# Altium schematic sheet ECU_Sheet1.SchDoc
size A3
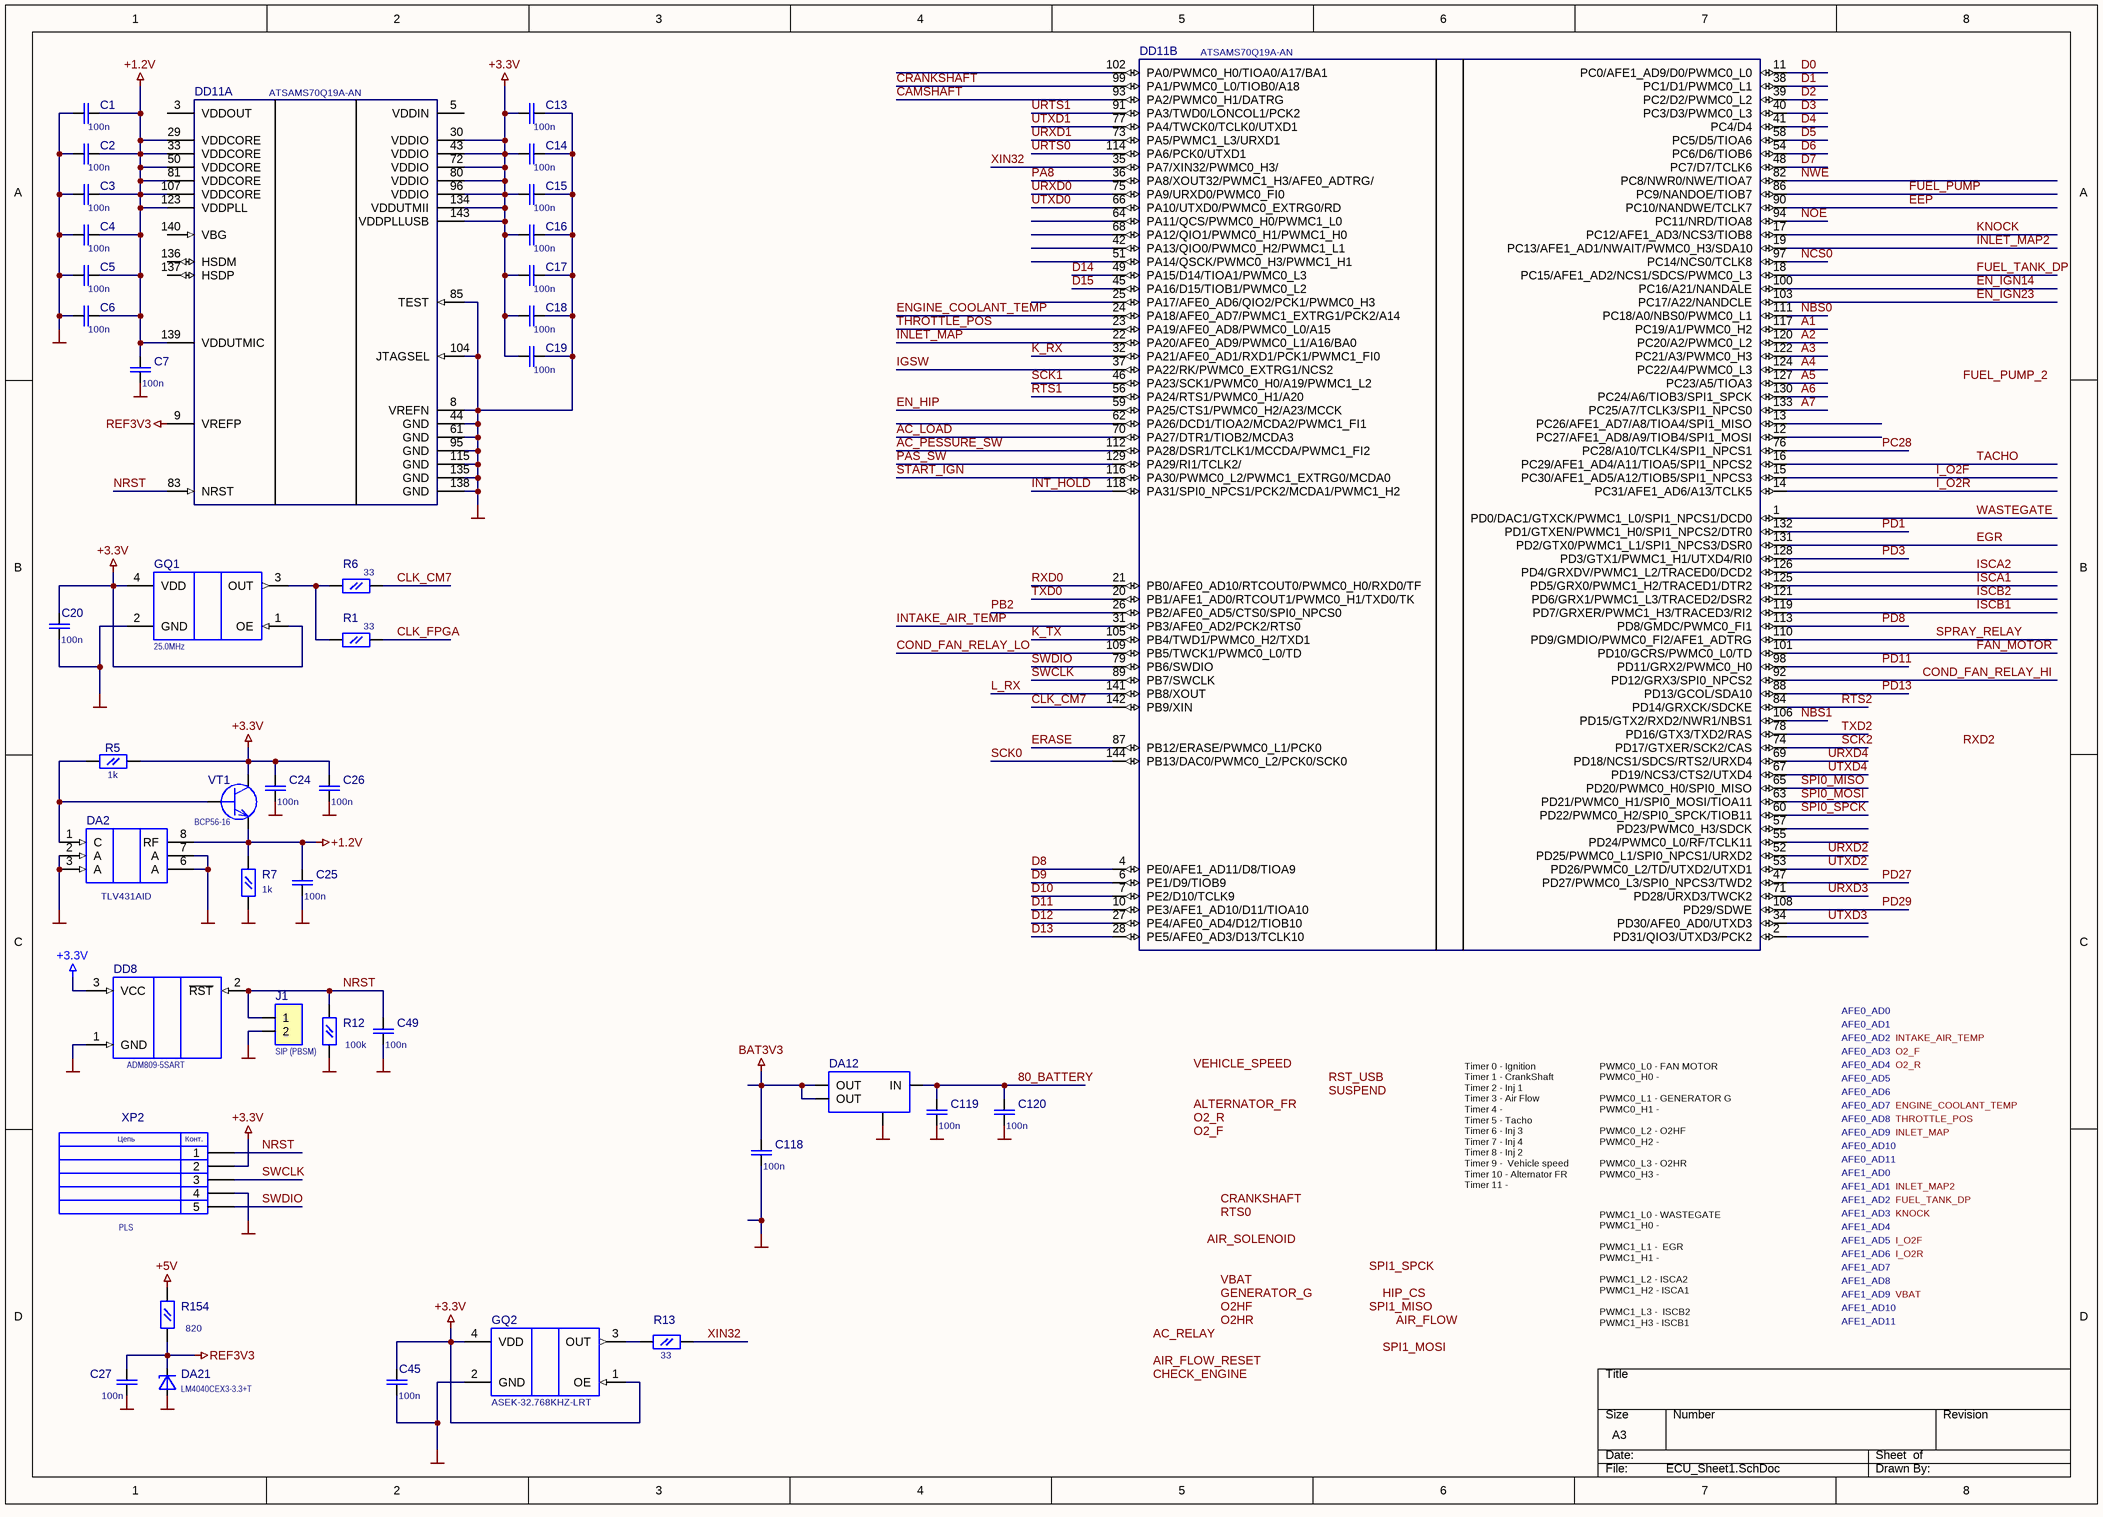
[diagram p0: ECU_Sheet1.SchDoc]

## Parts
C1  value 100n  [C0603L]  (hidden comment: 0.1мкФ-25В-X8R-10%)
C2  value 100n  [C0603L]  (hidden comment: 0.1мкФ-25В-X8R-10%)
C3  value 100n  [C0603L]  (hidden comment: 0.1мкФ-25В-X8R-10%)
C4  value 100n  [C0603L]  (hidden comment: 0.1мкФ-25В-X8R-10%)
C5  value 100n  [C0603L]  (hidden comment: 0.1мкФ-25В-X8R-10%)
C6  value 100n  [C0603L]  (hidden comment: 0.1мкФ-25В-X8R-10%)
C7  value 100n  [C0603L]  (hidden comment: 0.1мкФ-25В-X8R-10%)
C13  value 100n  [C0603L]  (hidden comment: 0.1мкФ-25В-X8R-10%)
C14  value 100n  [C0603L]  (hidden comment: 0.1мкФ-25В-X8R-10%)
C15  value 100n  [C0603L]  (hidden comment: 0.1мкФ-25В-X8R-10%)
C16  value 100n  [C0603L]  (hidden comment: 0.1мкФ-25В-X8R-10%)
C17  value 100n  [C0603L]  (hidden comment: 0.1мкФ-25В-X8R-10%)
C18  value 100n  [C0603L]  (hidden comment: 0.1мкФ-25В-X8R-10%)
C19  value 100n  [C0603L]  (hidden comment: 0.1мкФ-25В-X8R-10%)
C20  value 100n  [C0805L]  (hidden comment: 0.01мкФ-50В-X8R-10%)
C24  value 100n  [C0805L]  (hidden comment: 0.1мкФ-25В-X8R-10%)
C25  value 100n  [C0805L]  (hidden comment: 0.1мкФ-25В-X8R-10%)
C26  value 100n  [C0805L]  (hidden comment: 0.1мкФ-25В-X8R-10%)
C27  value 100n  [C0603L]  (hidden comment: 0.1мкФ-25В-X8R-10%)
C45  value 100n  [C0805L]  (hidden comment: 0.01мкФ-50В-X8R-10%)
C49  value 100n  [C0603L]  (hidden comment: 0.1мкФ-25В-X8R-10%)
C118  value 100n  [C0805L]  (hidden comment: 0.1мкФ-25В-X8R-10%)
C119  value 100n  [C0805L]  (hidden comment: CSMD)
C120  value 100n  [C0805L]  (hidden comment: CSMD)
DA2  TLV431AID  [SOIC8 JEDEC]
DA12  LM1117IMP-3.3  [SOT-223]  (value not drawn)
DA21  LM4040CEX3-3.3+T  [SOT-23]
DD8  ADM809-5SART  [SOT-23]
DD11  ATSAMS70Q19A-AN  [LQFP144]  (parts A,B of 2)
GQ1  25.0MHz  [KXO-97]
GQ2  ASEK-32.768KHZ-LRT  [QUARTZ-3.2mm-2.5mm]
J1  SIP (PBSM)  [SIP1X2S]
R1  value 33  [R0603L]  (hidden comment: 33-5%)
R5  value 1k  [R0805]  (hidden comment: 1к-5%)
R6  value 33  [R0603L]  (hidden comment: 33-5%)
R7  value 1k  [R0805L]  (hidden comment: 1к-5%)
R12  value 100k  [R0805L]  (hidden comment: 100к-5%)
R13  value 33  [R0603L]  (hidden comment: 33-5%)
R154  value 820  [R0805L]  (hidden comment: 100к-5%)
VT1  BCP56-16  [SOT-223 PWR]
XP2  PLS  [SIP5]

## Nets
+1.2V: C1.1 C2.1 C3.1 C4.1 C5.1 C6.1 C7.1 C25.1 DA2.8(RF) DD11.29(VDDCORE) DD11.33(VDDCORE) DD11.50(VDDCORE) DD11.81(VDDCORE) DD11.107(VDDCORE) DD11.123(VDDPLL) DD11.139(VDDUTMIC) R7.2(Pin2) VT1.3(E)
+3.3V: C13.2 C14.2 C15.2 C16.2 C17.2 C18.2 C19.2 C20.2 C24.1 C26.1 C45.2 DD8.3(VCC) DD11.30(VDDIO) DD11.43(VDDIO) DD11.72(VDDIO) DD11.80(VDDIO) DD11.96(VDDIO) DD11.134(VDDUTMII) DD11.143(VDDPLLUSB) GQ1.1(OE) GQ1.4(VDD) GQ2.1(OE) GQ2.4(VDD) R5.1(Pin1) VT1.2(C) XP2.2
+5V: R154.2(Pin2)
BAT3V3: C118.1 DA12.2(OUT) DA12.4(OUT)
GND: C1.2 C2.2 C3.2 C4.2 C5.2 C6.2 C7.2 C13.1 C14.1 C15.1 C16.1 C17.1 C18.1 C19.1 C20.1 C24.2 C25.2 C26.2 C27.2 C45.1 C49.2 C118.2 C119.2 C120.2 DA2.2(A) DA2.3(A) DA2.6(A) DA2.7(A) DA12.1(G) DA21.2 DD8.1(GND) DD11.8(VREFN) DD11.44(GND) DD11.61(GND) DD11.85(TEST) DD11.95(GND) DD11.104(JTAGSEL) DD11.115(GND) DD11.135(GND) DD11.138(GND) GQ1.2(GND) GQ2.2(GND) J1.2 R7.1(Pin1) R12.1(Pin1) XP2.4
REF3V3: C27.1 DA21.1 DD11.9(VREFP) R154.1(Pin1)
80_BATTERY: C119.1 C120.1 DA12.3(IN)
A1: DD11.117(PC19/A1/PWMC0_H2)
A2: DD11.120(PC20/A2/PWMC0_L2)
A3: DD11.122(PC21/A3/PWMC0_H3)
A4: DD11.124(PC22/A4/PWMC0_L3)
A5: DD11.127(PC23/A5/TIOA3)
A6: DD11.130(PC24/A6/TIOB3/SPI1_SPCK)
A7: DD11.133(PC25/A7/TCLK3/SPI1_NPCS0)
AC_LOAD: DD11.70(PA27/DTR1/TIOB2/MCDA3)
AC_PESSURE_SW: DD11.112(PA28/DSR1/TCLK1/MCCDA/PWMC1_FI2)
CAMSHAFT: DD11.93(PA2/PWMC0_H1/DATRG)
CLK_CM7: DD11.142(PB9/XIN) R6.2(Pin2)
CLK_FPGA: R1.2(Pin2)
COND_FAN_RELAY_HI: DD11.92(PD12/GRX3/SPI0_NPCS2)
COND_FAN_RELAY_LO: DD11.109(PB5/TWCK1/PWMC0_L0/TD)
CRANKSHAFT: DD11.99(PA1/PWMC0_L0/TIOB0/A18)
D0: DD11.11(PC0/AFE1_AD9/D0/PWMC0_L0)
D1: DD11.38(PC1/D1/PWMC0_L1)
D2: DD11.39(PC2/D2/PWMC0_L2)
D3: DD11.40(PC3/D3/PWMC0_L3)
D4: DD11.41(PC4/D4)
D5: DD11.58(PC5/D5/TIOA6)
D6: DD11.54(PC6/D6/TIOB6)
D7: DD11.48(PC7/D7/TCLK6)
D8: DD11.4(PE0/AFE1_AD11/D8/TIOA9)
D9: DD11.6(PE1/D9/TIOB9)
D10: DD11.7(PE2/D10/TCLK9)
D11: DD11.10(PE3/AFE1_AD10/D11/TIOA10)
D12: DD11.27(PE4/AFE0_AD4/D12/TIOB10)
D13: DD11.28(PE5/AFE0_AD3/D13/TCLK10)
D14: DD11.49(PA15/D14/TIOA1/PWMC0_L3)
D15: DD11.45(PA16/D15/TIOB1/PWMC0_L2)
EEP: DD11.90(PC10/NANDWE/TCLK7)
EGR: DD11.131(PD2/GTX0/PWMC1_L1/SPI1_NPCS3/DSR0)
EN_HIP: DD11.59(PA25/CTS1/PWMC0_H2/A23/MCCK)
EN_IGN14: DD11.100(PC16/A21/NANDALE)
EN_IGN23: DD11.103(PC17/A22/NANDCLE)
ENGINE_COOLANT_TEMP: DD11.24(PA18/AFE0_AD7/PWMC1_EXTRG1/PCK2/A14)
ERASE: DD11.87(PB12/ERASE/PWMC0_L1/PCK0)
FAN_MOTOR: DD11.101(PD10/GCRS/PWMC0_L0/TD)
FUEL_PUMP: DD11.86(PC9/NANDOE/TIOB7)
FUEL_TANK_DP: DD11.18(PC15/AFE1_AD2/NCS1/SDCS/PWMC0_L3)
I_O2F: DD11.15(PC30/AFE1_AD5/A12/TIOB5/SPI1_NPCS3)
I_O2R: DD11.14(PC31/AFE1_AD6/A13/TCLK5)
IGSW: DD11.37(PA22/RK/PWMC0_EXTRG1/NCS2)
INLET_MAP: DD11.22(PA20/AFE0_AD9/PWMC0_L1/A16/BA0)
INLET_MAP2: DD11.19(PC13/AFE1_AD1/NWAIT/PWMC0_H3/SDA10)
INT_HOLD: DD11.118(PA31/SPI0_NPCS1/PCK2/MCDA1/PWMC1_H2)
INTAKE_AIR_TEMP: DD11.31(PB3/AFE0_AD2/PCK2/RTS0)
ISCA1: DD11.125(PD5/GRX0/PWMC1_H2/TRACED1/DTR2)
ISCA2: DD11.126(PD4/GRXDV/PWMC1_L2/TRACED0/DCD2)
ISCB1: DD11.119(PD7/GRXER/PWMC1_H3/TRACED3/RI2)
ISCB2: DD11.121(PD6/GRX1/PWMC1_L3/TRACED2/DSR2)
K_RX: DD11.32(PA21/AFE0_AD1/RXD1/PCK1/PWMC1_FI0)
K_TX: DD11.105(PB4/TWD1/PWMC0_H2/TXD1)
KNOCK: DD11.17(PC12/AFE1_AD3/NCS3/TIOB8)
L_RX: DD11.141(PB8/XOUT)
NBS0: DD11.111(PC18/A0/NBS0/PWMC0_L1)
NBS1: DD11.106(PD15/GTX2/RXD2/NWR1/NBS1)
NCS0: DD11.97(PC14/NCS0/TCLK8)
NOE: DD11.94(PC11/NRD/TIOA8)
NRST: C49.1 DD8.2(~{RST}) DD11.83(NRST) J1.1 R12.2(Pin2) XP2.1
NWE: DD11.82(PC8/NWR0/NWE/TIOA7)
PA8: DD11.36(PA8/XOUT32/PWMC1_H3/AFE0_ADTRG/)
PAS_SW: DD11.129(PA29/RI1/TCLK2/)
PB2: DD11.26(PB2/AFE0_AD5/CTS0/SPI0_NPCS0)
PC28: DD11.76(PC28/A10/TCLK4/SPI1_NPCS1)
PD1: DD11.132(PD1/GTXEN/PWMC1_H0/SPI1_NPCS2/DTR0)
PD3: DD11.128(PD3/GTX1/PWMC1_H1/UTXD4/RI0)
PD8: DD11.113(PD8/GMDC/PWMC0_FI1)
PD11: DD11.98(PD11/GRX2/PWMC0_H0)
PD13: DD11.88(PD13/GCOL/SDA10)
PD27: DD11.47(PD27/PWMC0_L3/SPI0_NPCS3/TWD2)
PD29: DD11.108(PD29/SDWE)
RTS1: DD11.56(PA24/RTS1/PWMC0_H1/A20)
RTS2: DD11.84(PD14/GRXCK/SDCKE)
RXD0: DD11.21(PB0/AFE0_AD10/RTCOUT0/PWMC0_H0/RXD0/TF)
SCK0: DD11.144(PB13/DAC0/PWMC0_L2/PCK0/SCK0)
SCK1: DD11.46(PA23/SCK1/PWMC0_H0/A19/PWMC1_L2)
SCK2: DD11.74(PD17/GTXER/SCK2/CAS)
SPI0_MISO: DD11.65(PD20/PWMC0_H0/SPI0_MISO)
SPI0_MOSI: DD11.63(PD21/PWMC0_H1/SPI0_MOSI/TIOA11)
SPI0_SPCK: DD11.60(PD22/PWMC0_H2/SPI0_SPCK/TIOB11)
SPRAY_RELAY: DD11.110(PD9/GMDIO/PWMC0_FI2/AFE1_ADTRG)
START_IGN: DD11.116(PA30/PWMC0_L2/PWMC1_EXTRG0/MCDA0)
SWCLK: DD11.89(PB7/SWCLK) XP2.3
SWDIO: DD11.79(PB6/SWDIO) XP2.5
TACHO: DD11.16(PC29/AFE1_AD4/A11/TIOA5/SPI1_NPCS2)
THROTTLE_POS: DD11.23(PA19/AFE0_AD8/PWMC0_L0/A15)
TXD0: DD11.20(PB1/AFE1_AD0/RTCOUT1/PWMC0_H1/TXD0/TK)
TXD2: DD11.78(PD16/GTX3/TXD2/RAS)
URTS0: DD11.114(PA6/PCK0/UTXD1)
URTS1: DD11.91(PA3/TWD0/LONCOL1/PCK2)
URXD0: DD11.75(PA9/URXD0/PWMC0_FI0)
URXD1: DD11.73(PA5/PWMC1_L3/URXD1)
URXD2: DD11.52(PD25/PWMC0_L1/SPI0_NPCS1/URXD2)
URXD3: DD11.71(PD28/URXD3/TWCK2)
URXD4: DD11.69(PD18/NCS1/SDCS/RTS2/URXD4)
UTXD0: DD11.66(PA10/UTXD0/PWMC0_EXTRG0/RD)
UTXD1: DD11.77(PA4/TWCK0/TCLK0/UTXD1)
UTXD2: DD11.53(PD26/PWMC0_L2/TD/UTXD2/UTXD1)
UTXD3: DD11.34(PD30/AFE0_AD0/UTXD3)
UTXD4: DD11.67(PD19/NCS3/CTS2/UTXD4)
WASTEGATE: DD11.1(PD0/DAC1/GTXCK/PWMC1_L0/SPI1_NPCS1/DCD0)
XIN32: DD11.35(PA7/XIN32/PWMC0_H3/) R13.2(Pin2)
NetDA2_1: DA2.1(C) R5.2(Pin2) VT1.1(B)
NetGQ1_3: GQ1.3(OUT) R1.1(Pin1) R6.1(Pin1)
NetGQ2_3: GQ2.3(OUT) R13.1(Pin1)

Not connected (* = marked no-connect by the designer): DD11 2(PD31/QIO3/UTXD3/PCK2) 3(VDDOUT) 5(VDDIN) 12(PC27/AFE1_AD8/A9/TIOB4/SPI1_MOSI) 13(PC26/AFE1_AD7/A8/TIOA4/SPI1_MISO) 25(PA17/AFE0_AD6/QIO2/PCK1/PWMC0_H3) 42(PA13/QIO0/PWMC0_H2/PWMC1_L1) 51(PA14/QSCK/PWMC0_H3/PWMC1_H1) 55(PD24/PWMC0_L0/RF/TCLK11) 57(PD23/PWMC0_H3/SDCK) 62(PA26/DCD1/TIOA2/MCDA2/PWMC1_FI1) 64(PA11/QCS/PWMC0_H0/PWMC1_L0) 68(PA12/QIO1/PWMC0_H1/PWMC1_H0) 102(PA0/PWMC0_H0/TIOA0/A17/BA1) 136(HSDM) 137(HSDP) 140(VBG)

## Notes on the sheet
- AFE0_AD0
- AFE0_AD1
- AFE0_AD2
- AFE0_AD3
- AFE0_AD4
- AFE0_AD5
- AFE0_AD6
- AFE0_AD7
- AFE0_AD8
- Timer 0 - Ignition
  Timer 1 - CrankShaft
  Timer 2 - Inj 1
  Timer 3 - Air Flow
  Timer 4 -
  Timer 5 - Tacho
  Timer 6 - Inj 3
  Timer 7 - Inj 4
  Timer 8 - Inj 2
  Timer 9 -  Vehicle speed
  Timer 10 - Alternator FR
  Timer 11 -
- PWMC0_L0 - FAN MOTOR
  PWMC0_H0 -
  PWMC0_L1 - GENERATOR G
  PWMC0_H1 -
  PWMC0_L2 - O2HF
  PWMC0_H2 -
  PWMC0_L3 - O2HR
  PWMC0_H3 -
- AFE0_AD9
- AFE0_AD10
- AFE0_AD11
- AFE1_AD0
- AFE1_AD1
- AFE1_AD2
- AFE1_AD3
- AFE1_AD4
- AFE1_AD5
- AFE1_AD6
- AFE1_AD7
- AFE1_AD8
- AFE1_AD9
- AFE1_AD10
- AFE1_AD11
- PWMC1_L0 - WASTEGATE
  PWMC1_H0 -
  PWMC1_L1 -  EGR
  PWMC1_H1 -
  PWMC1_L2 - ISCA2
  PWMC1_H2 - ISCA1
  PWMC1_L3 -  ISCB2
  PWMC1_H3 - ISCB1
- Labels drawn without touching a wire or pin: AC_RELAY, AIR_FLOW, AIR_FLOW_RESET, AIR_SOLENOID, ALTERNATOR_FR, CHECK_ENGINE, CRANKSHAFT, ENGINE_COOLANT_TEMP, FUEL_PUMP_2, FUEL_TANK_DP, GENERATOR_G, HIP_CS, I_O2F, I_O2R, INLET_MAP, INLET_MAP2, INTAKE_AIR_TEMP, KNOCK, O2_F, O2_R, O2HF, O2HR, RST_USB, RTS0, RXD2, SPI1_MISO, SPI1_MOSI, SPI1_SPCK, SUSPEND, THROTTLE_POS, VBAT, VEHICLE_SPEED
- (in symbol CONNSIP5) Цепь; Конт.

## Library data of the parts
C1-C7 C13-C20 C24-C27 C45 C49 C118-C120 = CSMD: C0603; Voltage: *; Part Field 1: *; Part Field 2: *
DA2 = TL431AID
DA21 = LM4040: Improved Precision Micropower Shunt Voltage Reference
GQ1 = KXO-V97T: KXO-V97T 25.0 MHz; Part Field 1: KXО-V97
GQ2 = ASEMB-8.000MHZ-LY
J1 = CON2: Part Field 2: 2 конт.
R1 R6 R12 R13 R154 = RSMD: R0805; Part Field 1: *; Part Field 2: *
R5 R7 = RSMD: R0805; Part Field 1: 0603; Part Field 2: *
XP2 = CONNSIP5: Value: *; Part Field 2: 5 конт.
DA12 = LM1117IMP-3.3: Value: *
VT1 = BCP56-16: Value: *